# Altium schematic sheet S7CAS-PLEIADES-CARTE-MERE_Pxx_IO_SENSOR.SchDoc
size Tabloid; SheetNumber: 14; SheetTotal: 18; Sheet_Name: BTN, LED, TEMP SENSOR; Size: 11x17
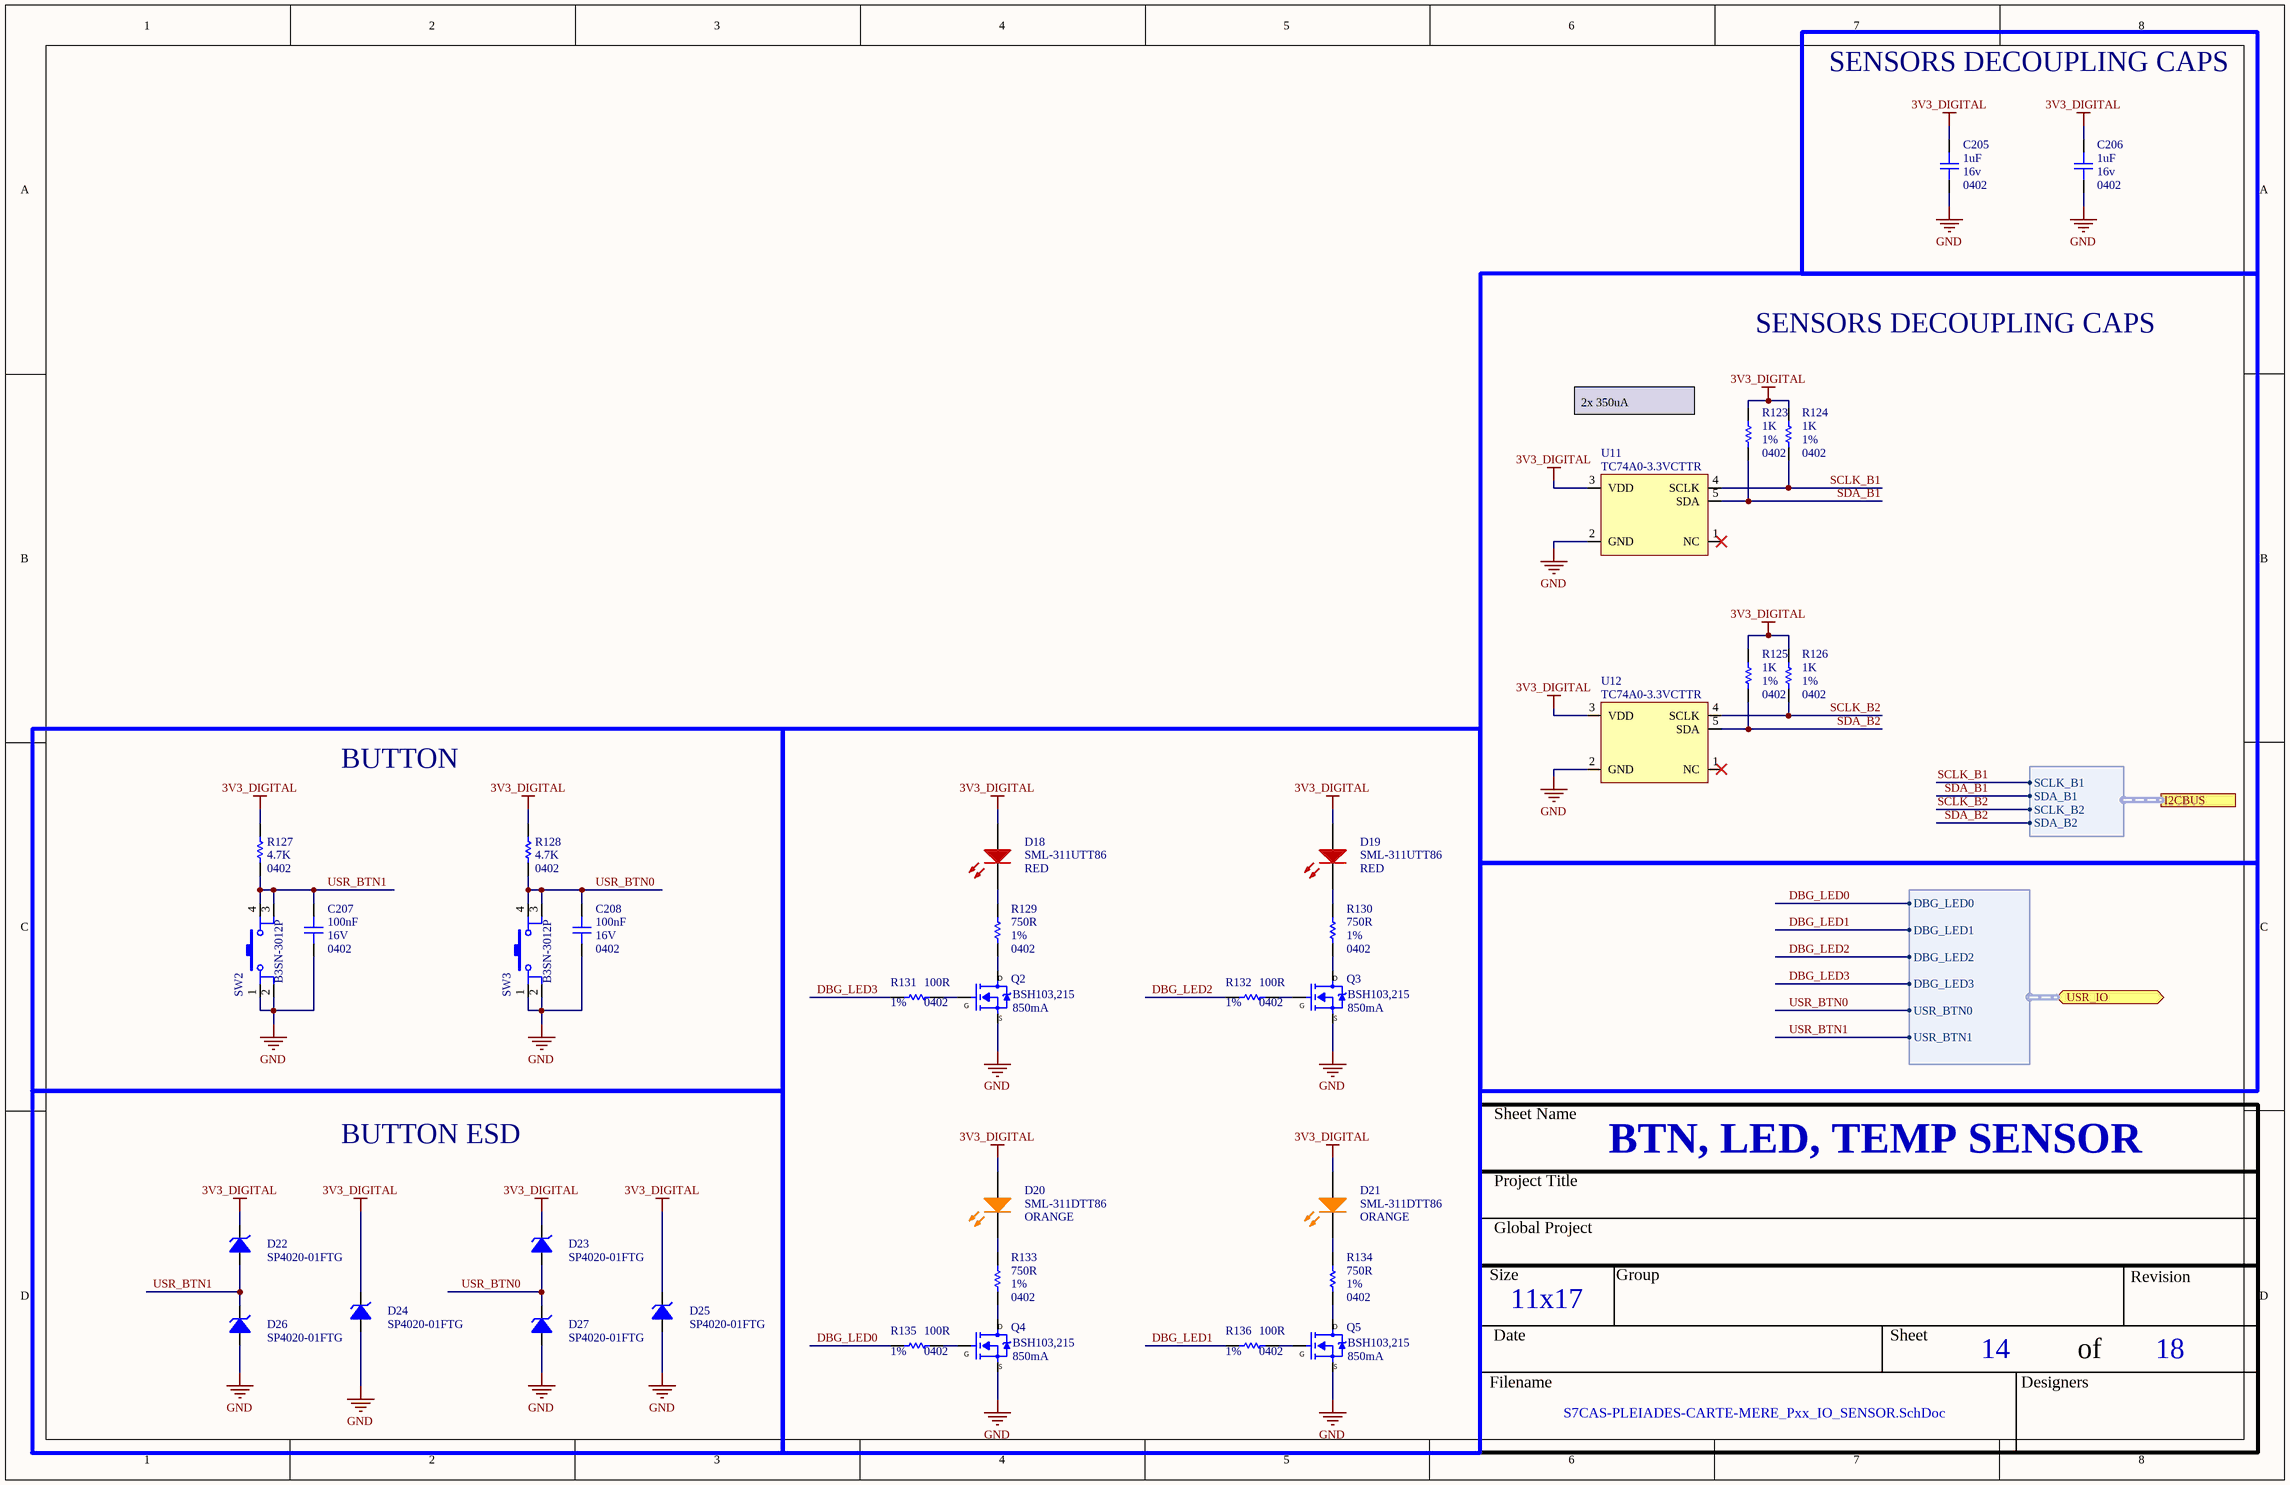
[diagram p0: S7CAS-PLEIADES-CARTE-MERE_Pxx_IO_SENSOR.SchDoc]

## Parts
C205  value 1uF  Voltage: 16v  [CAP_0402]  (hidden comment: 0402)
C206  value 1uF  Voltage: 16v  [CAP_0402]  (hidden comment: 0402)
C207  value 100nF  Voltage: 16V  [CAP_0402]  (hidden comment: 0402)
C208  value 100nF  Voltage: 16V  [CAP_0402]  (hidden comment: 0402)
D18  SML-311UTT86  value RED  [LED_0603]
D19  SML-311UTT86  value RED  [LED_0603]
D20  SML-311DTT86  value ORANGE  [LED_0603]
D21  SML-311DTT86  value ORANGE  [LED_0603]
D22  SP4020-01FTG  [SOD323 - UNIDIR]
D23  SP4020-01FTG  [SOD323 - UNIDIR]
D24  SP4020-01FTG  [SOD323 - UNIDIR]
D25  SP4020-01FTG  [SOD323 - UNIDIR]
D26  SP4020-01FTG  [SOD323 - UNIDIR]
D27  SP4020-01FTG  [SOD323 - UNIDIR]
Q2  BSH103,215  Current: 850mA  [SOT23-3]
Q3  BSH103,215  Current: 850mA  [SOT23-3]
Q4  BSH103,215  Current: 850mA  [SOT23-3]
Q5  BSH103,215  Current: 850mA  [SOT23-3]
R123  value 1K  Package: 0402  Precision: 1%  [RES_0402]  (hidden comment: RES - 0603)
R124  value 1K  Package: 0402  Precision: 1%  [RES_0402]  (hidden comment: RES - 0603)
R125  value 1K  Package: 0402  Precision: 1%  [RES_0402]  (hidden comment: RES - 0603)
R126  value 1K  Package: 0402  Precision: 1%  [RES_0402]  (hidden comment: RES - 0603)
R127  value 4.7K  Package: 0402  [RES_0402]  (hidden comment: RES - 0603)
R128  value 4.7K  Package: 0402  [RES_0402]  (hidden comment: RES - 0603)
R129  value 750R  Package: 0402  Precision: 1%  [RES_0402]  (hidden comment: RES - 0603)
R130  value 750R  Package: 0402  Precision: 1%  [RES_0402]  (hidden comment: RES - 0603)
R131  value 100R  Package: 0402  Precision: 1%  [RES_0402]  (hidden comment: RES - 0603)
R132  value 100R  Package: 0402  Precision: 1%  [RES_0402]  (hidden comment: RES - 0603)
R133  value 750R  Package: 0402  Precision: 1%  [RES_0402]  (hidden comment: RES - 0603)
R134  value 750R  Package: 0402  Precision: 1%  [RES_0402]  (hidden comment: RES - 0603)
R135  value 100R  Package: 0402  Precision: 1%  [RES_0402]  (hidden comment: RES - 0603)
R136  value 100R  Package: 0402  Precision: 1%  [RES_0402]  (hidden comment: RES - 0603)
SW2  B3SN-3012P  [SWI_TACT_B3SN-3012P]
SW3  B3SN-3012P  [SWI_TACT_B3SN-3012P]
U11  TC74A0-3.3VCTTR  [SEN_TEMP_TC74A0-3.3VCTTR]
U12  TC74A0-3.3VCTTR  [SEN_TEMP_TC74A0-3.3VCTTR]

## Blocks framed on the sheet
SENSORS DECOUPLING CAPS: C205 C206
SENSORS DECOUPLING CAPS: R123-R126 U11 U12
BUTTON: C207 C208 R127 R128 SW2 SW3
BUTTON ESD: D22-D27

## Ports
I2CBUS (harness Harness, see S7CAS-PLEIADES-CARTE-MERE_Pxx_FPGA_bank3[5C]), USR_IO (bidir, harness USER_IOS_HARNESS, see S7CAS-PLEIADES-CARTE-MERE_Pxx_FPGA_bank3[5C])

## Harnesses
USER_IOS_HARNESS: DBG_LED0, DBG_LED1, DBG_LED2, DBG_LED3, USR_BTN0, USR_BTN1
Harness: SCLK_B1, SDA_B1, SCLK_B2, SDA_B2

## Nets
3V3_DIGITAL: C205.2 C206.2 D18.A D19.A D20.A D21.A D22.1 D23.1 D24.1 D25.1 R123.2 R124.2 R125.2 R126.2 R127.2 R128.2 U11.3(VDD) U12.3(VDD)
GND: C205.1 C206.1 C207.1 C208.1 D24.2 D25.2 D26.2 D27.2 Q2.2 Q3.2 Q4.2 Q5.2 SW2.1 SW2.2 SW3.1 SW3.2 U11.2(GND) U12.2(GND)
DBG_LED0: R135.2 ; port USR_IO.DBG_LED0
DBG_LED1: R136.2 ; port USR_IO.DBG_LED1
DBG_LED2: R132.2 ; port USR_IO.DBG_LED2
DBG_LED3: R131.2 ; port USR_IO.DBG_LED3
SCLK_B1: R124.1 U11.4(SCLK) ; port I2CBUS.SCLK_B1
SCLK_B2: R126.1 U12.4(SCLK) ; port I2CBUS.SCLK_B2
SDA_B1: R123.1 U11.5(SDA) ; port I2CBUS.SDA_B1
SDA_B2: R125.1 U12.5(SDA) ; port I2CBUS.SDA_B2
USR_BTN0: C208.2 D23.2 D27.1 R128.1 SW3.3 SW3.4 ; port USR_IO.USR_BTN0
USR_BTN1: C207.2 D22.2 D26.1 R127.1 SW2.3 SW2.4 ; port USR_IO.USR_BTN1
NetD18_K: D18.K R129.2
NetD19_K: D19.K R130.2
NetD20_K: D20.K R133.2
NetD21_K: D21.K R134.2
NetQ2_1: Q2.1 R131.1
NetQ2_3: Q2.3 R129.1
NetQ3_1: Q3.1 R132.1
NetQ3_3: Q3.3 R130.1
NetQ4_1: Q4.1 R135.1
NetQ4_3: Q4.3 R133.1
NetQ5_1: Q5.1 R136.1
NetQ5_3: Q5.3 R134.1

Not connected (* = marked no-connect by the designer): U11 1(NC)*; U12 1(NC)*

## Notes on the sheet
- 2x 350uA
- Sheet Name
- Project Title
- Global Project
- Size
- Group
- Revision
- Date
- Sheet
- of
- Filename
- Designers
- (in symbol MOS_N_CHANNEL) D; G; S

## Library data of the parts
C205-C208 = CAP - 0603: CAP - 0402; Precision: 10%; Current: *; CreatedBy: Jonathan Bouchard; Power: *; Package: 0402; Supplier 1: Arrow Electronics
  C205 C206: Supplier Part Number 1: CL10B105MO8NNWC
  C207 C208: Supplier Part Number 1: CL10B104KO8NNNC
D18 D19 = LED_SML-311UTT86: LED - 620nM RED 2mA - 0603; Voltage: 1.8V; Mfg: ROHM Semiconductor; Power: 44mW; Current: 2mA; HelpURL: http://media.digikey.com/pdf/Data%20Sheets/Rohm%20PDFs/SML-311%20Series.pdf; CreatedBy: Jonathan Bouchard; Temperature: -30°C to 85°C; Package: 0603; Precision: *; Mfg Part Number: SML-311UTT86; Supplier 1: Digikey; Supplier Part Number 1: 511-1304-1-ND
D20 D21 = LED_SML-311DTT86: LED - 611nM ORANGE 2mA - 0603; Voltage: 1.8V; Mfg: ROHM Semiconductor; Power: 44mW; Current: 2mA; HelpURL: http://media.digikey.com/pdf/Data%20Sheets/Rohm%20PDFs/SML-311%20Series.pdf; CreatedBy: Jonathan Bouchard; Temperature: -40°C to 85°C; Package: 0603; Precision: *; Mfg Part Number: SML-311DTT86; Supplier 1: Digikey; Supplier Part Number 1: 511-1303-1-ND
D22-D27 = TVS_SP4020-01FTG: TVS - 3.3VWM 21.8V (Typ) Clamp 30A (8/20µs) Ipp Tvs Diode Surface Mount SOD-323; GRAMS Lib Spec: 2.7; Supplier 1: Future Electronics; Supplier Part Number 1: 6058247
Q2-Q5 = MOS_N_CHANNEL: N-Channel  Enhancement Mode Field Effect Transistor; Mfr: *; Package / Case: *; Vds: *; Rds ON: *; Vgs: *; Operating Temperature: *; Supplier 1: Avnet; Supplier Part Number 1: BSH103,215
R123-R126 R129-R136 = RES - 0603: RES - 0402; Current: *; CreatedBy: Jonathan Bouchard
  R129 R130 R133 R134: Supplier 1: Arrow Electronics; Supplier Part Number 1: RMCF0603FT750R
  R131 R132 R135 R136: Supplier 1: Arrow Electronics; Supplier Part Number 1: RMCF0603FT100R
R127 R128 = RES - 0603: RES - 0402; Precision: 1%; Current: *; CreatedBy: Jonathan Bouchard; Supplier 1: Arrow Electronics; Supplier Part Number 1: RMCF0603FT4K70
SW2 SW3 = SWI_TACT_B3SN-3012P: SWI - TACT SPST-NO 0.05A 24V - 4-SMD; Current: 50mA; Mfg: Omron; Mfg Part Number: B3SN-3012P; HelpURL: http://www.omron.com/ecb/products/pdf/en-b3sn.pdf; CreatedBy: Jonathan Bouchard; Temperature: -25°C ~ 70°C; Power: *; Precision: *; Package: 4-SMD; Value: *; Voltage: 24V; Supplier 1: Digikey; Supplier Part Number 1: SW261CT-ND
U11 U12 = SENS_TEMP_TC74A0-3.3VCTTR: SENS - TEMPERATURE SENSOR I2C/SMBUS - SOT23-5; Voltage: 2.7 V ~ 5.5 V; Mfg: Microchip; Precision: ±2°C (±3°C); Current: *; Power: *; Mfg Part Number: TC74A0-3.3VCTTR; HelpURL: http://ww1.microchip.com/downloads/en/DeviceDoc/21462D.pdf; CreatedBy: Jonathan Bouchard; Temperature: -40°C ~ 125°C; Value: *; Package: SOT23-5; Supplier 1: Digikey; Supplier Part Number 1: TC74A0-3.3VCTDKR-ND